# Altium schematic sheet MotorController.SchDoc
size A4
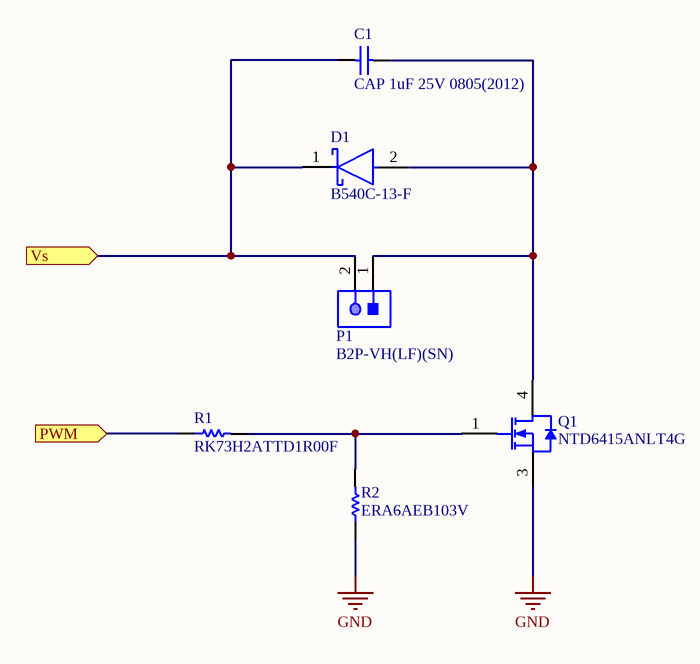
[diagram p0: MotorController.SchDoc]

## Parts
C1  CAP 1uF 25V 0805(2012)  [CAPC0805(2012)145_L]
D1  B540C-13-F  [FP-SMC-MFG]
P1  B2P-VH(LF)(SN)  [JST-B2P-VH(LF)(SN)_V]
Q1  NTD6415ANLT4G  [ONSC-DPAK-3-369AA-01_V]
R1  RK73H2ATTD1R00F  [RESC2013X60X30NL20T20]
R2  ERA6AEB103V  [RESC2013X60X40ML20T25]

## Ports
PWM (in), Vs (in)

## Nets
GND: Q1.3(S) R2.1
PWM: R1.1 ; port PWM
Vs: C1.1 D1.1(C) P1.2 ; port Vs
NetC1_2: C1.2 D1.2(A) P1.1 Q1.4(D)
NetQ1_1: Q1.1(G) R1.2 R2.2

## Notes on the sheet
- Date:
- Sheet
- of
- Time:
- Revision:
- Drawn by:
- File:

## Library data of the parts
C1 = CMP-1036-04757-1: CAP 1uF 25V -20% to +80% 0805 (2012 Metric) Thickness 1.45mm SMD; Case-Metric: 2012; Case-EIA: 0805; Max Thickness: 1.45 mm; Tolerance: -20% to +80%; Rated Voltage: 25 V; Technology: SMT; Value: 1uF
D1 = CMP-12790-000056-1: DIODE SCHOTTKY 40V 5A SMC; Manufacturer: Diodes Inc.; Description: Diode Schottky 40V 5A Surface Mount SMC; Automotive Grade: NA; Peak Reverse Current: 0.5mA; Value: 300pF; Max Junction Temp: +150°C; Max Surge Forward Current: 100A; Standoff Height: 0.1mm; Digikey Description: DIODE SCHOTTKY 40V 5A SMC; Temperature Range Low: -55°C; Manufacturer Part Number: B540C-13-F; Octopart: https://octopart.com/b540c-13-f-diodes+inc.-325873; Lead Free: Yes; Reverse Voltage: 40V; RoHS: TRUE; Category: Diode; Mouser Description: Diode: Schottky rectifying; SMD; 40V; 5A; SMC; Package: reel, tape; ComponentLink2Description: Datasheet; Temperature Range High: +150°C; Automotive: No; Footprint Url: https://www.diodes.com/assets/Package-Files/SMC.pdf; Device Class L3: Schottky Diodes; Height: 2.5mm; Forward Current: 5A; Temperature: -55°C to +150°C; Package: SMC; ComponentLink2URL: https://www.diodes.com/assets/Datasheets/ds13012.pdf; Device Class L2: Diodes; Max Repetitive Reverse Voltage: 40V; Device Class L1: Discrete Semiconductors; Capacitance: 300pF
P1 = CMP-1755-00002-1: Male Header, Pitch 3.96 mm, 1 x 2 Position, Height 10.9 mm, Tail Length 3.7 mm, -25 to 85 degC, RoHS, Bulk; Capacitance: 27 pF; Type (Capacitors): C0G; Voltage Rating (DC): 50 V; Resistance: 100000000000 Ohm; Tolerance: 5%; ComponentLink2Description: Datasheet; Height: 0.8 mm; Radiation Hardening: No; Pins: 2; Package Quantity: 4000; Max Operating Temperature: 125degC; Width: 0.8 mm; PackageDescription: Male Header, Pitch 3.96 mm, 1 x 2 Position, Height 10.9 mm, Tail Length 3.7 mm; Case/Package: 0603; PackageReference: B2P-VH(LF)(SN); Voltage Rating: 50 V; REACH SVHC: No SVHC; Mount: Surface Mount; Min Operating Temperature: -55degC; Case Code (Metric): 1608; ComponentLink2URL: http://www.jst-mfg.com/product/pdf/eng/eVH.pdf; DatasheetVersion: May-16; RoHSCompliant: True; ComponentLink1Description: Manufacturer URL; Case Code (Imperial): 0603; Length: 1.6 mm; Packaging: Tape and Reel; ComponentLink1URL: http://www.jst.com/home2.html
Q1 = CMP-1058-00352-1: N-Channel Power MOSFET, 100 V, 23 A, 56 mOhm, 3-Pin DPAK, Pb-Free, Tape and Reel; Manufacturer: On Semiconductor; VGS(th) Max (V): 2; ID Max (A): 23; VGS Max (V): 20; Configuration: Single; Coss Typ (pF): 156; Crss Typ (pF): 70; Qrr Typ (nC): 152; Ciss Typ (pF): 1024; Channel Polarity: N Channel; PD Max (W): 83; ComponentLink1URL: http://www.onsemi.com/; Mounting Technology: Surface Mount; ComponentLink2URL: http://www.onsemi.cn/pub_link/Collateral/NTD6415ANL-D.PDF; RoHS: Pb-Free; PackageVersion: Rev. B, 06/2010; Packing: Tape and Reel; PackageReference: DPAK-3-369AA-01; DatasheetVersion: Rev. 1; ComponentLink1Description: Manufacturer URL; Package Type: DPAK-3; PackageDescription: 3-Pin Flange Mount, Body 6.54 x 6.095 mm, Pitch 2.29 mm; ComponentLink3URL: http://www.onsemi.cn/pub_link/Collateral/369AA.PDF; ComponentLink3Description: Package Specification; PartNumber: NTD6415ANLT4G; ComponentLink2Description: Datasheet
R1 = CMP-2001-02169-1: Manufacturer: KOA Speer; Part Number: RK73H2ATTD1R00F
R2 = CMP-2001-00582-1: Manufacturer: Panasonic; Part Number: ERA6AEB103V